# EAGLE design PortExpanderXRA1207 v2 (EAGLE 7.2.0)
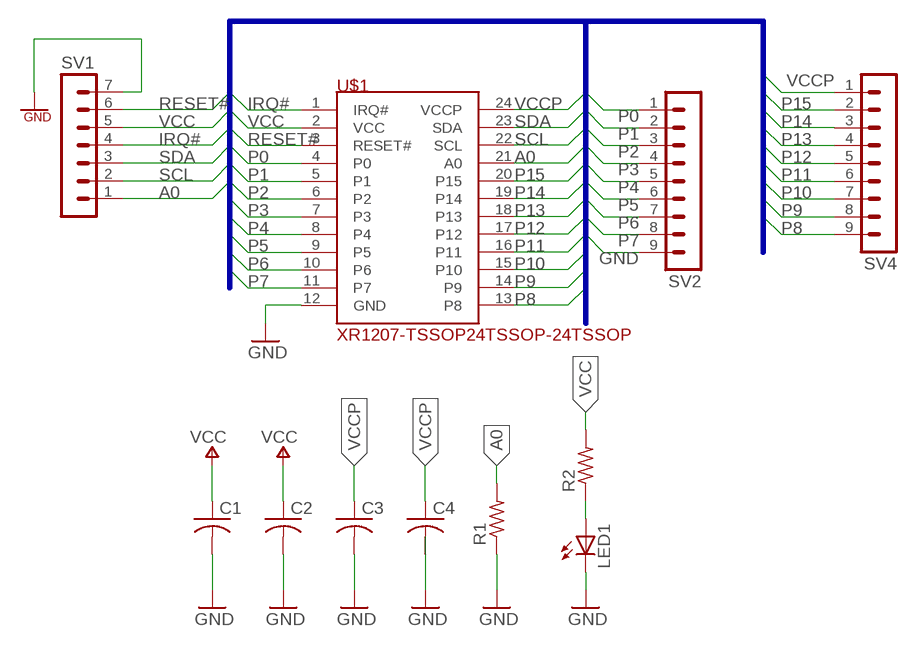
[diagram p0: schematic, sheet 1]

## Parts
C1  C-USC1206  [C1206]
C2  C-USC1206  [C1206]
C3  C-USC1206  [C1206]
C4  C-USC1206  [C1206]
LED1  LEDSML0805  [SML0805]
R1  R-US_M1206  [M1206]
R2  R-US_M1206  [M1206]
SV1  MA07-1  [MA07-1]
SV2  MA09-1  [MA09-1]
SV4  MA09-1  [MA09-1]
U$1  XR1207-TSSOP24TSSOP-24TSSOP  [TSSOP-24]

## Nets
A0: R1.2 SV1.1 U$1.21(A0)
GND: C1.2 C2.2 C3.2 C4.2 LED1.C R1.1 SV1.7 SV2.9 U$1.12(GND)
IRQ#: SV1.4 U$1.1(IRQ#)
N$1: LED1.A R2.1
P0: SV2.1 U$1.4(P0)
P1: SV2.2 U$1.5(P1)
P2: SV2.3 U$1.6(P2)
P3: SV2.4 U$1.7(P3)
P4: SV2.5 U$1.8(P4)
P5: SV2.6 U$1.9(P5)
P6: SV2.7 U$1.10(P6)
P7: SV2.8 U$1.11(P7)
P8: SV4.9 U$1.13(P8)
P9: SV4.8 U$1.14(P9)
P10: SV4.7 U$1.15(P10)
P11: SV4.6 U$1.16(P11)
P12: SV4.5 U$1.17(P12)
P13: SV4.4 U$1.18(P13)
P14: SV4.3 U$1.19(P14)
P15: SV4.2 U$1.20(P15)
RESET#: SV1.6 U$1.3(RESET#)
SCL: SV1.2 U$1.22(SCL)
SDA: SV1.3 U$1.23(SDA)
VCC: C1.1 C2.1 R2.2 SV1.5 U$1.2(VCC)
VCCP: C3.1 C4.1 SV4.1 U$1.24(VCCP)

## Buses
A0,IRQ#,VCC,RESET#,VCCP,SDA,SCL,GND,P0,P1,P2,P3,P4,P5,P6,P7,P8,P9,P10,P11,P12,P13,P14,P15

## Library data of the parts
C1-C4 = resistor:C-US: CAPACITOR, American symbol
LED1 = led:LED: LED OSRAM: - CHIPLED LG R971, LG N971, LY N971, LG Q971, LY Q971, LO R971, LY R971 LH N974, LH R974 LS Q976, LO Q976, LY Q976 LO Q996 - Hyper CHIPLED LW Q18S LB Q993, LB Q99A, LB R99A - SideLED LS A670, LO A670, LY A670, LG A670, LP A670 LB A673, LV A673, LT A673, LW A673 LH A674 LY A675 LS A676, LA A676, LO A676, LY A676, LW A676 LS A679, LY A679, LG A679 - Hyper Micro SIDELED® LS Y876, LA Y876, LO Y876, LY Y876 LT Y87S - SmartLED LW L88C, LW L88S LB L89C, LB L89S, LG L890 LS L89K, LO L89K, LY L89K LS L896, LA L896, LO L896, LY L896 - TOPLED LS T670, LO T670, LY T670, LG T670, LP T670 LSG T670, LSP T670, LSY T670, LOP T670, LYG T670 LG T671, LOG T671, LSG T671 LB T673, LV T673, LT T673, LW T673 LH T674 LS T676, LA T676, LO T676, LY T676, LB T676, LH T676, LSB T676, LW T676 LB T67C, LV T67C, LT T67C, LS T67K, LO T67K, LY T67K, LW E67C LS E67B, LA E67B, LO E67B, LY E67B, LB E67C, LV E67C, LT E67C LW T67C LS T679, LY T679, LG T679 LS T770, LO T770, LY T770, LG T770, LP T770 LB T773, LV T773, LT T773, LW T773 LH T774 LS E675, LA E675, LY E675, LS T675 LS T776, LA T776, LO T776, LY T776, LB T776 LHGB T686 LT T68C, LB T68C - Hyper Mini TOPLED® LB M676 - Mini TOPLED Santana® LG M470 LS M47K, LO M47K, LY M47K Source: http://www.osram.convergy.de LUXEON: - LUMILED® LXK2-PW12-R00, LXK2-PW12-S00, LXK2-PW14-U00, LXK2-PW14-V00 LXK2-PM12-R00, LXK2-PM12-S00, LXK2-PM14-U00 LXK2-PE12-Q00, LXK2-PE12-R00, LXK2-PE12-S00, LXK2-PE14-T00, LXK2-PE14-U00 LXK2-PB12-K00, LXK2-PB12-L00, LXK2-PB12-M00, LXK2-PB14-N00, LXK2-PB14-P00, LXK2-PB14-Q00 LXK2-PR12-L00, LXK2-PR12-M00, LXK2-PR14-Q00, LXK2-PR14-R00 LXK2-PD12-Q00, LXK2-PD12-R00, LXK2-PD12-S00 LXK2-PH12-R00, LXK2-PH12-S00 LXK2-PL12-P00, LXK2-PL12-Q00, LXK2-PL12-R00 Source: www.luxeon.com KINGBRIGHT: KA-3528ASYC Source: www.kingbright.com
R1 R2 = resistor:R-US_: RESISTOR, American symbol
SV1 = con-lstb:MA07-1: PIN HEADER; OC_FARNELL: unknown; OC_NEWARK: unknown
SV2 SV4 = con-lstb:MA09-1: PIN HEADER; OC_FARNELL: unknown; OC_NEWARK: unknown
U$1 = HCloudLib:XR1207-TSSOP24

## Board
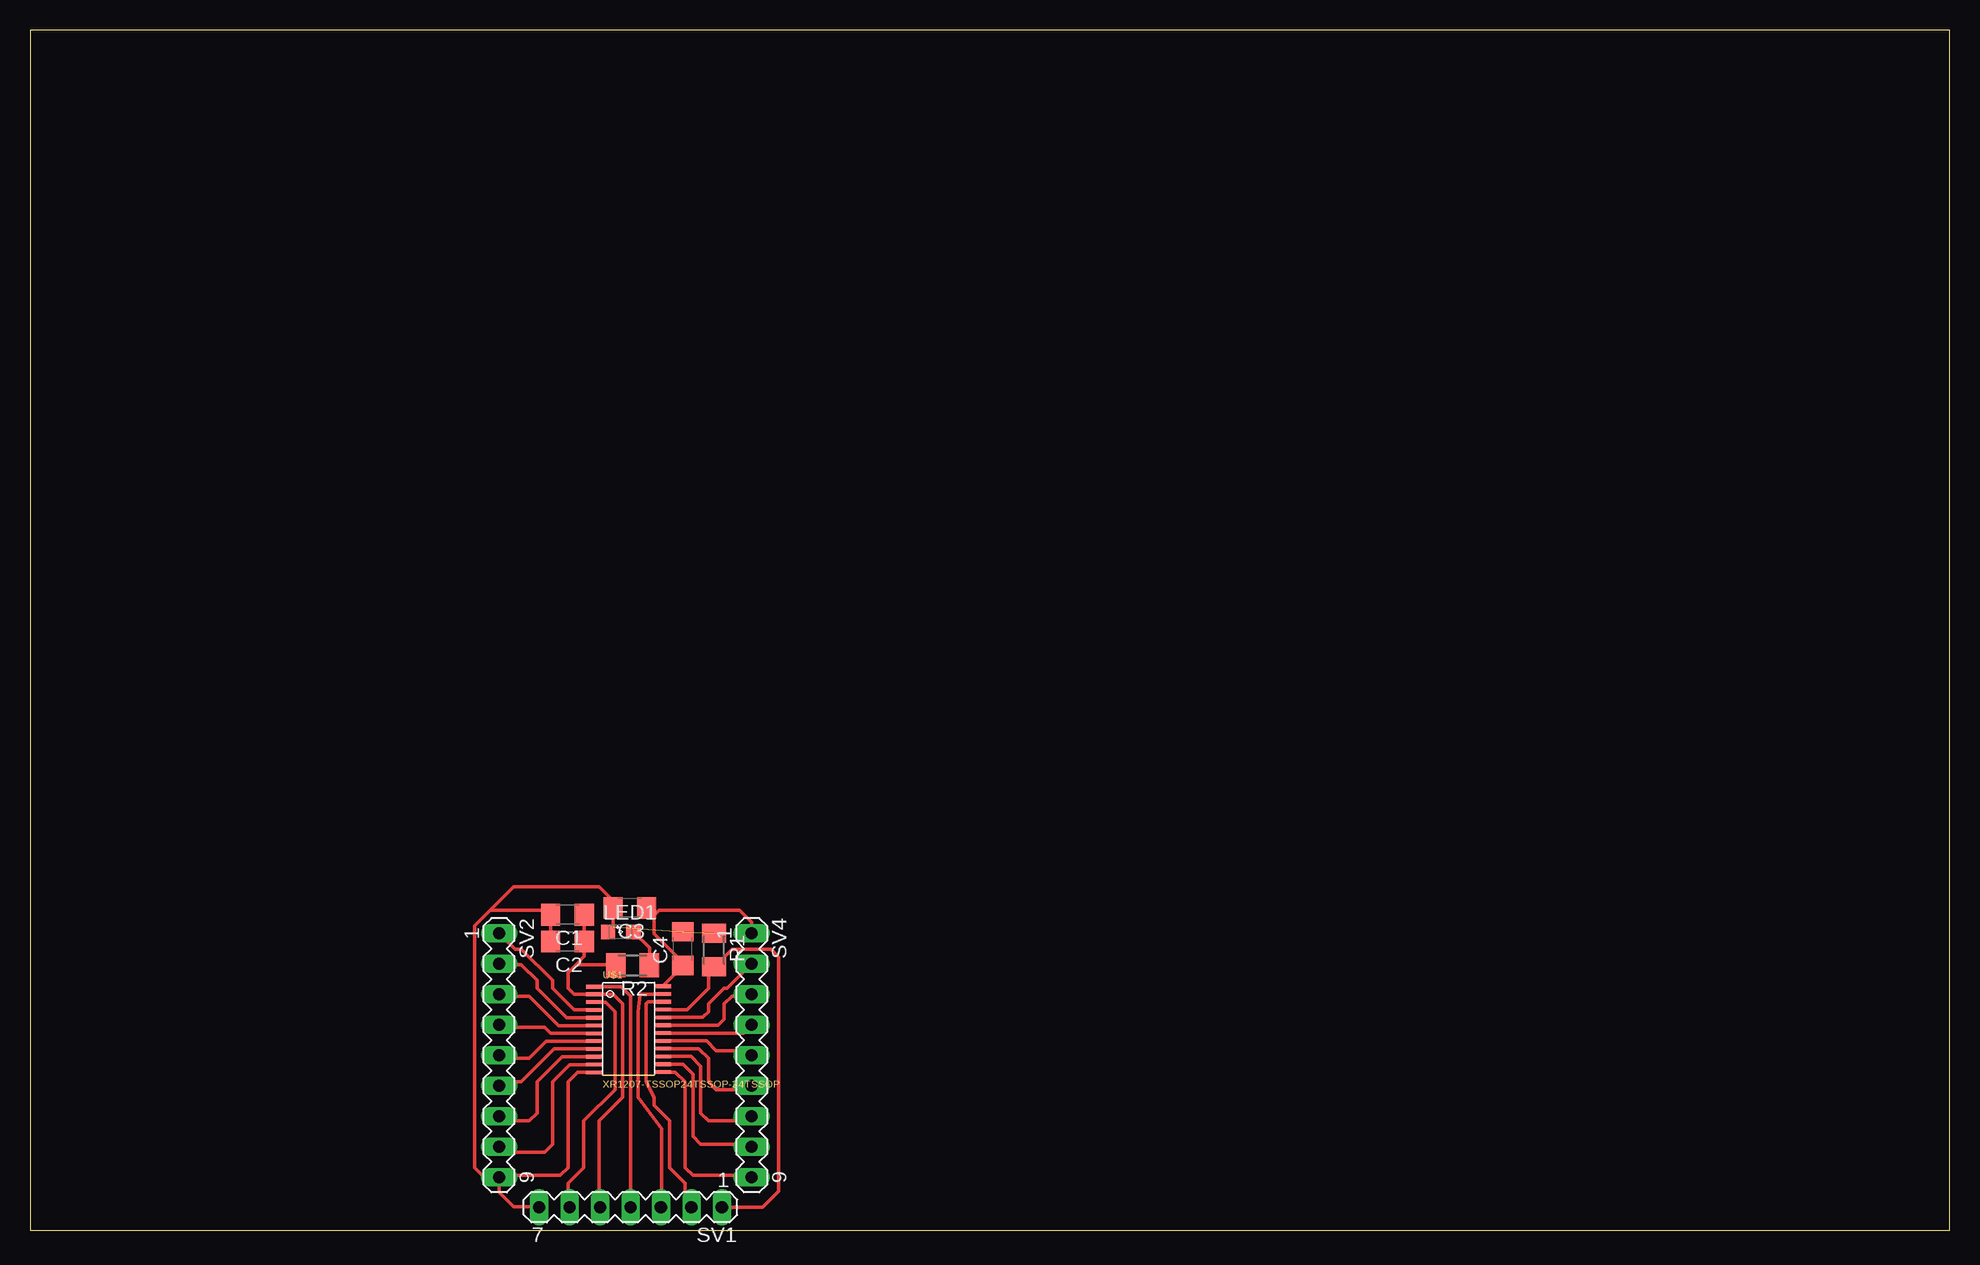
[diagram p1: board, top side]

Size 160 x 100 mm. Coordinates in mm from the lower left corner, seen from the top.
Outline: 0,0 160,0 160,100 0,100 0,0
Copper layers (1*16): Top 0.035mm / dielectric 1.5mm / Bottom 0.035mm
Design rules "default": minimum track width 10mil, minimum drill 24mil, track to track 8mil, track to pad 8mil, pad to pad 8mil, via to via 8mil, smd to smd 8mil, copper to edge 40mil, drill to drill 8mil, minimum pad ring 10mil, minimum via ring 8mil, stop-mask expansion 4mil, vias tented up to drill 0mil, thermal gap 10mil

### Footprints (pad centres in the part's own frame; a part is rotated, then mirrored left to right if it is on the bottom)
C1206 = smd 1.6 x 1.8: 1 -1.4,0; 2 1.4,0
SML0805 = smd 1.2 x 1.2: A 1.05,0; C -1.05,0
M1206 = smd 1.6 x 2: 1 -1.4,0; 2 1.4,0
MA07-1 = drill 1.016 long: 1 -7.62,0; 2 -5.08,0; 3 -2.54,0; 4 0,0; 5 2.54,0; 6 5.08,0; 7 7.62,0
MA09-1 = drill 1.016 long: 1 -10.16,0; 2 -7.62,0; 3 -5.08,0; 4 -2.54,0; 5 0,0; 6 2.54,0; 7 5.08,0; 8 7.62,0; 9 10.16,0
TSSOP-24 = smd 1.4 x 0.305: 1 -0.65,-0.025; 2 -0.65,-0.65; 3 -0.65,-1.3; 4 -0.65,-1.951; 5 -0.65,-2.601; 6 -0.65,-3.251; 7 -0.65,-3.901; 8 -0.65,-4.552; 9 -0.65,-5.202; 10 -0.65,-5.852; 11 -0.65,-6.502; 12 -0.65,-7.153; 13 4.999,-7.127; 14 4.999,-6.477; 15 4.999,-5.827; 16 4.999,-5.177; 17 4.999,-4.526; 18 4.999,-3.876; 19 4.999,-3.226; 20 4.999,-2.576; 21 4.999,-1.925; 22 4.999,-1.275; 23 4.999,-0.625; 24 4.999,0.025

### Placement (x,y rotation side)
C1  44.8,26.27 180 top
C2  44.8,24.03 180 top
C3  50,26.83 180 top
C4  54.42,23.45 90 top
LED1  49.24,24.85 0 top
R1  57.02,23.33 270 top
R2  50.23,22.05 180 top
SV1  50.05,1.9 180 top
SV2  39.1,14.56 270 top
SV4  60.15,14.56 270 top
U$1  47.72,20.29 0 top

### Tracks (layer width: path | path; a pad name or v marks a point on that pad's centre or on a via)
A0
  Top 0.3: U$1.21 54.77,18.36 56.55,20.15 56.55,21.46 R1.2 57.84,22.75 57.85,22.75 58.5,23.4 61.75,23.4 62.4,22.75 62.4,3.25 61.05,1.9 SV1.1
GND  (2 unrouted)
  Top 0.3: U$1.12 45.64,13.14 44.85,12.35 44.85,5.2 44.2,4.55 39.25,4.55 SV2.9 | SV2.9 39.1,3.15 40.3,1.95 42.38,1.95 SV1.7 | 38.35,26.65 37.05,25.35 37.05,5.2 37.7,4.55 38.95,4.55 SV2.9 | 38.35,26.65 43.02,26.65 C1.2 C2.2 | 38.35,26.65 40.3,28.6 47.45,28.6 48.6,27.45 C3.2 48.6,25.26 LED1.C
IRQ#
  Top 0.3: U$1.1 49.28,20.27 50.05,19.5 SV1.4
N$1
  Top 0.3: R2.1 51.63,23.51 LED1.A
P0
  Top 0.3: U$1.4 45.36,18.34 43.55,20.15 43.55,20.8 40.95,23.4 40.42,23.4 SV2.1
P1
  Top 0.3: U$1.5 44.71,17.69 42.25,20.15 42.25,20.8 40.95,22.1 39.18,22.1 SV2.2
P2
  Top 0.3: U$1.6 44.06,17.04 41.6,19.5 39.24,19.5 SV2.3
P3
  Top 0.3: U$1.7 43.41,16.39 42.9,16.9 39.3,16.9 SV2.4
P4
  Top 0.3: U$1.8 43.04,15.74 41.6,14.3 39.36,14.3 SV2.5
P5
  Top 0.3: U$1.9 43.69,15.09 40.95,12.35 39.43,12.35 SV2.6
P6
  Top 0.3: U$1.10 44.34,14.44 42.25,12.35 42.25,9.75 41.6,9.1 39.48,9.1 SV2.7
P7
  Top 0.3: U$1.11 44.99,13.79 43.55,12.35 43.55,7.15 42.9,6.5 39.54,6.5 SV2.8
P8
  Top 0.3: U$1.13 53.79,13.16 54.6,12.35 54.6,5.2 55.25,4.55 60,4.55 SV4.9
P9
  Top 0.3: U$1.14 54.44,13.81 55.25,13 55.25,7.8 55.9,7.15 59.94,7.15 SV4.8
P10
  Top 0.3: U$1.15 55.09,14.46 55.9,13.65 55.9,9.75 56.55,9.1 59.77,9.1 SV4.7
P11
  Top 0.3: U$1.16 55.74,15.11 56.55,14.3 56.55,12.35 57.2,11.7 59.83,11.7 SV4.6
P12
  Top 0.3: U$1.17 56.39,15.76 57.2,14.95 59.76,14.95 SV4.5
P13
  Top 0.3: U$1.18 59.46,16.41 SV4.4
P14
  Top 0.3: U$1.19 57.36,17.06 57.85,17.55 57.85,18.85 58.5,19.5 60.01,19.5 SV4.3
P15
  Top 0.3: U$1.20 56.06,17.71 56.55,18.2 56.55,18.85 57.85,20.15 58.12,20.15 SV4.2
RESET#
  Top 0.3: U$1.3 47.96,18.99 48.75,18.2 48.75,11.7 46.15,9.1 46.15,5.2 44.85,3.9 44.85,2.02 SV1.6
SCL
  Top 0.3: U$1.22 51.52,19.02 51.35,18.85 51.35,12.35 52,11.05 52,10.4 53.3,9.1 53.3,5.2 54.6,3.9 54.6,2.43 SV1.2
SDA
  Top 0.3: U$1.23 50.87,19.66 50.7,18.2 50.7,11.05 52.65,8.45 52.65,1.96 SV1.3
VCC
  Top 0.3: SV1.5 47.45,1.96 47.45,9.1 49.4,11.05 49.4,18.85 48.61,19.64 U$1.2 45.36,19.64 44.85,20.15 44.85,21.45 45.5,22.1 | 45.5,22.1 48.78,22.1 R2.2 | 45.5,22.1 46.2,22.8 C2.1 C1.1
VCCP
  Top 0.3: 51.87,27.3 C3.1 52,26.23 | U$1.24 54.42,22.02 C4.1 54.42,22.28 52,24.7 52,26.23 | SV4.1 60.15,25.65 59.15,26.65 52.42,26.65 52,26.23